# EasyEDA schematic 2 SensorArraySchematic.json
TITLE: line Sensor Array; REV: 1.0; Date: 2018-01-19; Sheet: 1/1; Drawn By: K S S M Kamal
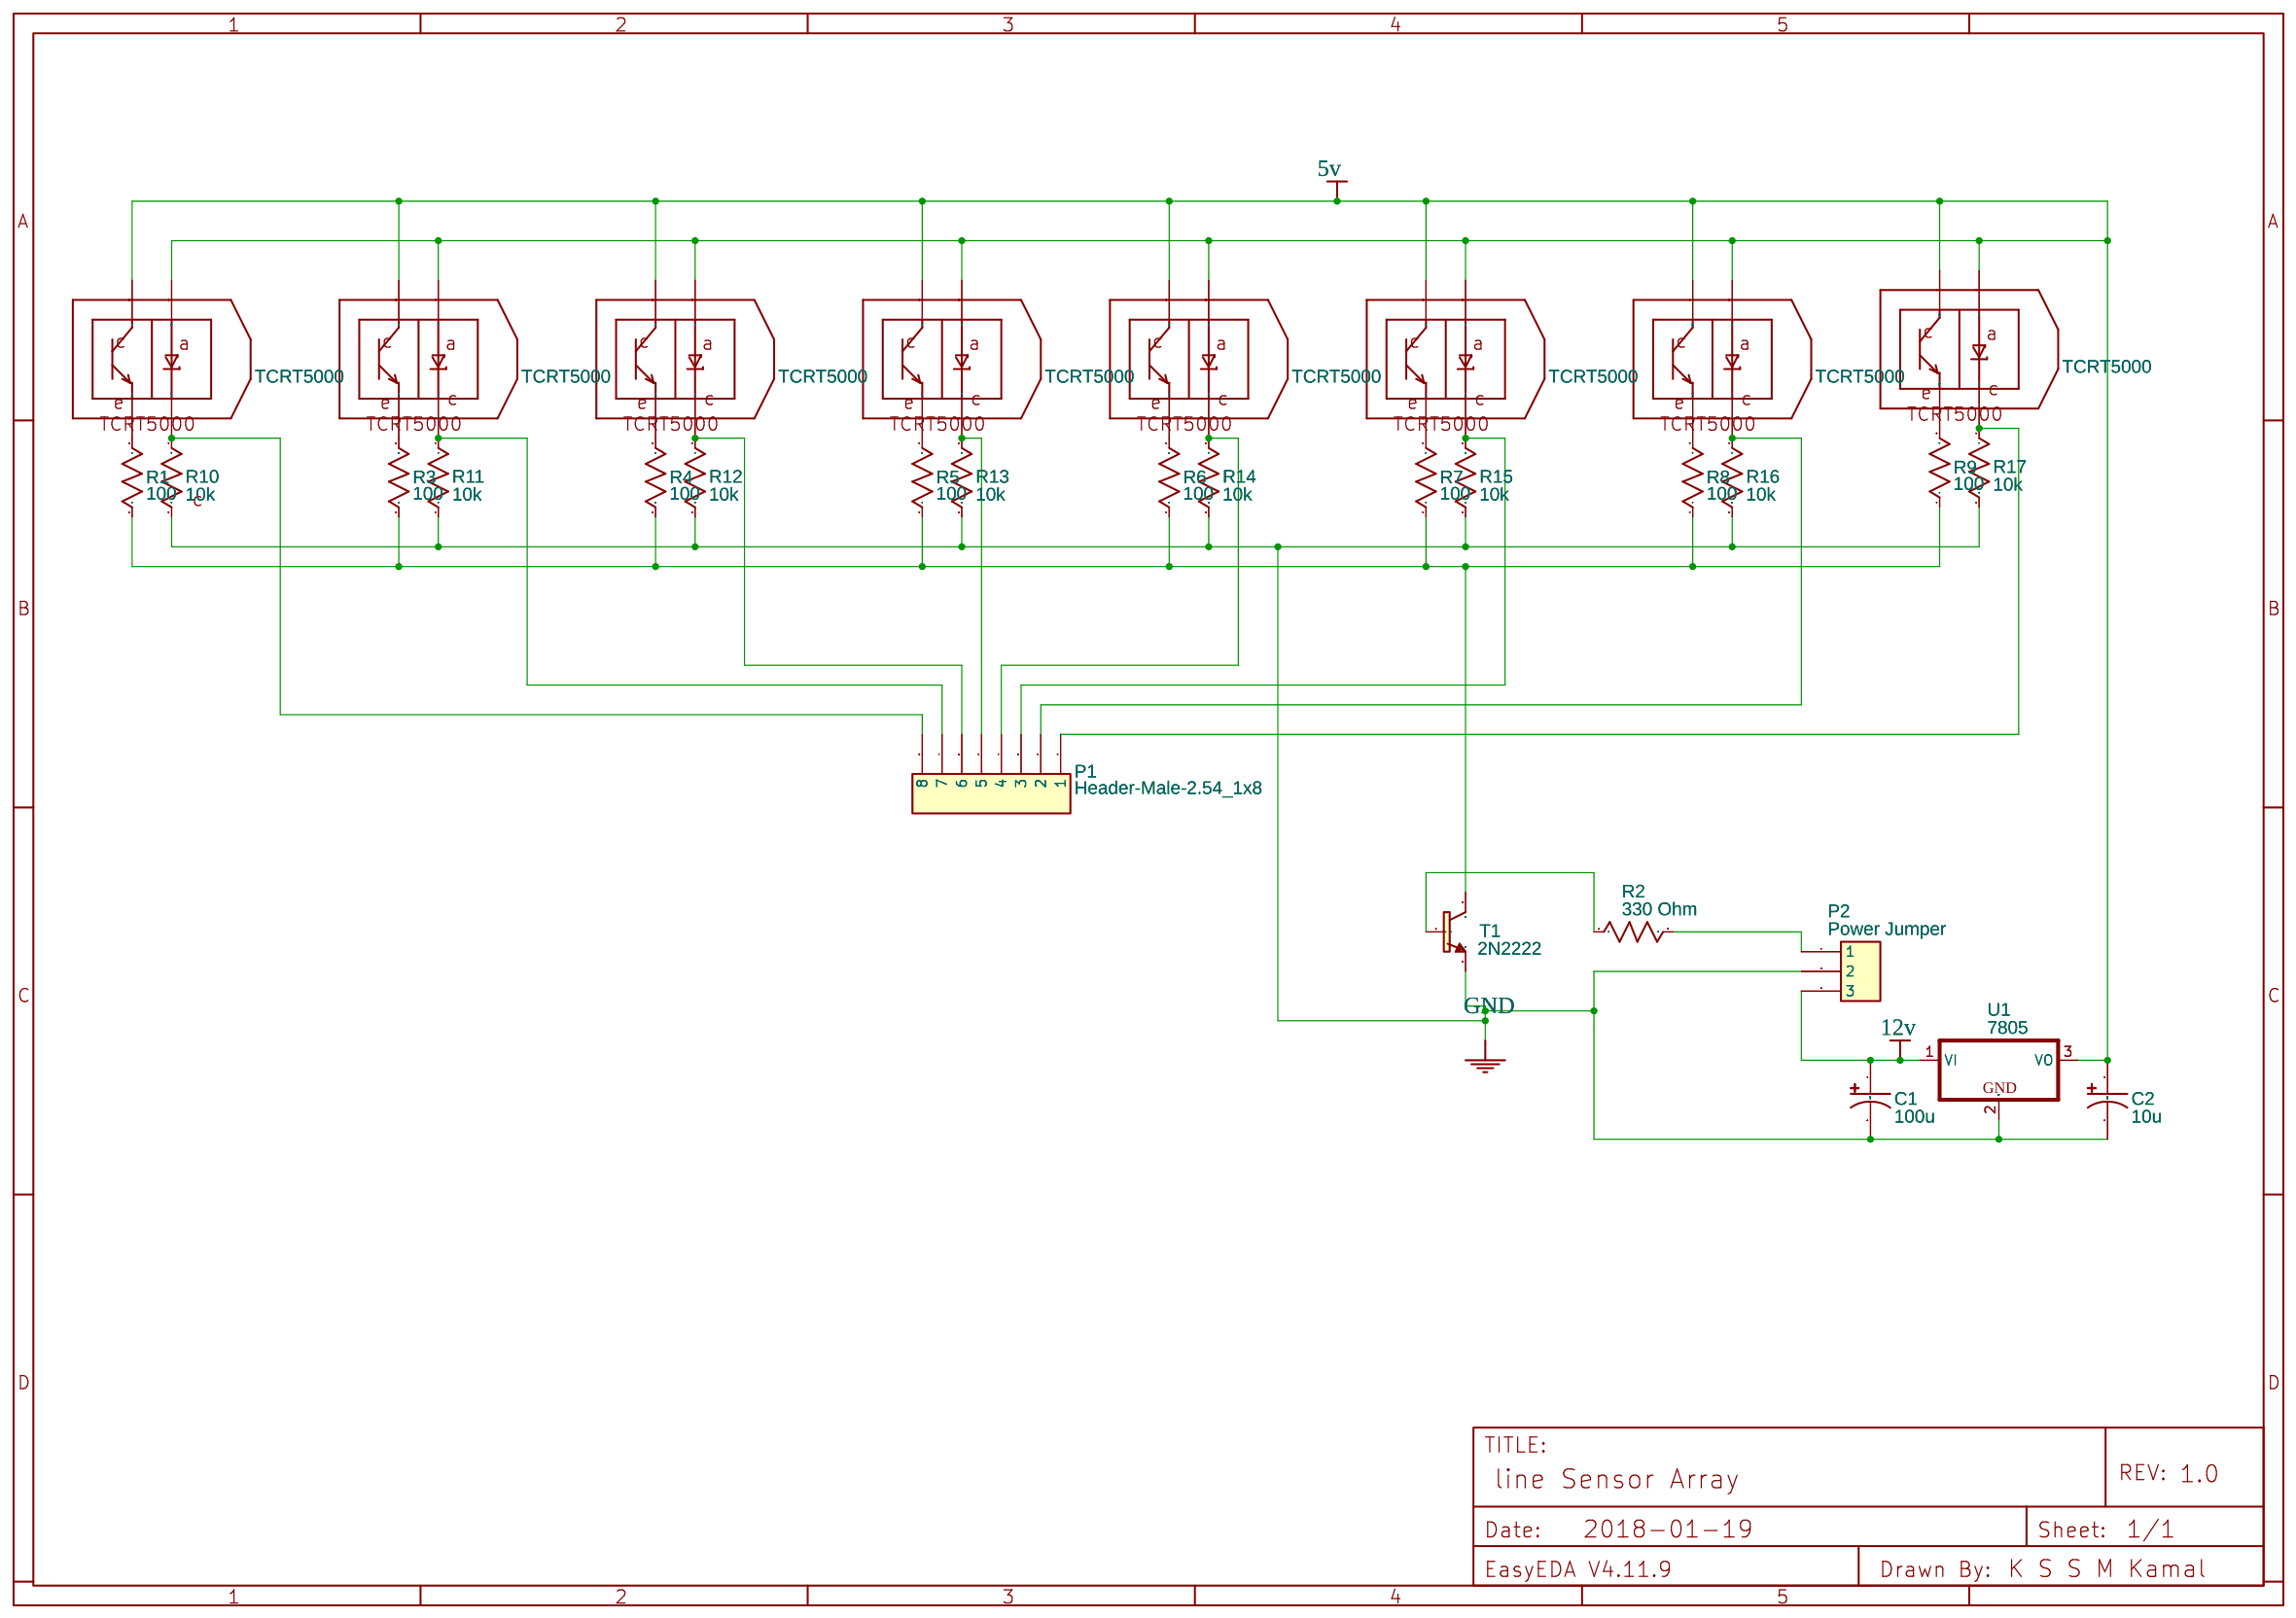
[diagram p0: schematic sheet]

## Parts
C1  100u  [CAP-D3.0XF1.5]
C2  10u  [CAP-D3.0XF1.5]
P1  Header-Male-2.54_1x8  [HDR-8X1/2.54]
P2  Power Jumper  [HDR-3X1/2.54]
R1  100  [AXIAL-0.4]
R2  330 Ohm  [AXIAL-0.4]
R3  100  [AXIAL-0.4]
R4  100  [AXIAL-0.4]
R5  100  [AXIAL-0.4]
R6  100  [AXIAL-0.4]
R7  100  [AXIAL-0.4]
R8  100  [AXIAL-0.4]
R9  100  [AXIAL-0.4]
R10  10k  [AXIAL-0.4]
R11  10k  [AXIAL-0.4]
R12  10k  [AXIAL-0.4]
R13  10k  [AXIAL-0.4]
R14  10k  [AXIAL-0.4]
R15  10k  [AXIAL-0.4]
R16  10k  [AXIAL-0.4]
R17  10k  [AXIAL-0.4]
S1  TCRT5000  [5000]
S2  TCRT5000  [5000]
S3  TCRT5000  [5000]
S4  TCRT5000  [5000]
S5  TCRT5000  [5000]
S6  TCRT5000  [5000]
S7  TCRT5000  [5000]
S8  TCRT5000  [5000]
T1  2N2222  [TO92-EBC-OVAL]
U1  7805  [TO220H]

## Library data of the parts
C1 C2 = Capacitor: Manufacturer Part: ?
P1 = -: LCSC: C49256; Supplier: LCSC; Manufacturer: LCSC
P2 = -: LCSC: C49257; Supplier: LCSC; Manufacturer: LCSC; Manufacturer Part: Header-Male-2.54_1x3
R1-R17 = Resistor: Manufacturer Part: ?
S1-S8 = -: catid: 20; Manufacturer Part: ?
T1 U1 = -: catid: 20; Contributor: Adafruit; Manufacturer Part: ?

## Nets
5v: C2.1 S1.P$1 S1.P$3 S2.P$1 S2.P$3 S3.P$1 S3.P$3 S4.P$1 S4.P$3 S5.P$1 S5.P$3 S6.P$1 S6.P$3 S7.P$1 S7.P$3 S8.P$1 S8.P$3 U1.3(VO)
12v: C1.1 P2.3 U1.1(VI)
GND: C1.2 C2.2 P2.2 R10.2 R11.2 R12.2 R13.2 R14.2 R15.2 R16.2 R17.2 T1.E U1.2(GND)
Net-(P1-1): P1.1 R17.1 S8.P$4
Net-(P1-2): P1.2 R16.1 S7.P$4
Net-(P1-3): P1.3 R15.1 S6.P$4
Net-(P1-4): P1.4 R14.1 S5.P$4
Net-(P1-5): P1.5 R13.1 S4.P$4
Net-(P1-6): P1.6 R12.1 S3.P$4
Net-(P1-7): P1.7 R11.1 S2.P$4
Net-(P1-8): P1.8 R10.1 S1.P$4
Net-(P2-1): P2.1 R2.2
Net-(R1-1): R1.1 R3.1 R4.1 R5.1 R6.1 R7.1 R8.1 R9.1 T1.C
Net-(R1-2): R1.2 S1.P$2
Net-(R2-1): R2.1 T1.B
Net-(R3-2): R3.2 S2.P$2
Net-(R4-2): R4.2 S3.P$2
Net-(R5-2): R5.2 S4.P$2
Net-(R6-2): R6.2 S5.P$2
Net-(R7-2): R7.2 S6.P$2
Net-(R8-2): R8.2 S7.P$2
Net-(R9-2): R9.2 S8.P$2
